# Altium project [G04]_QuadCharger18650.PrjPcb
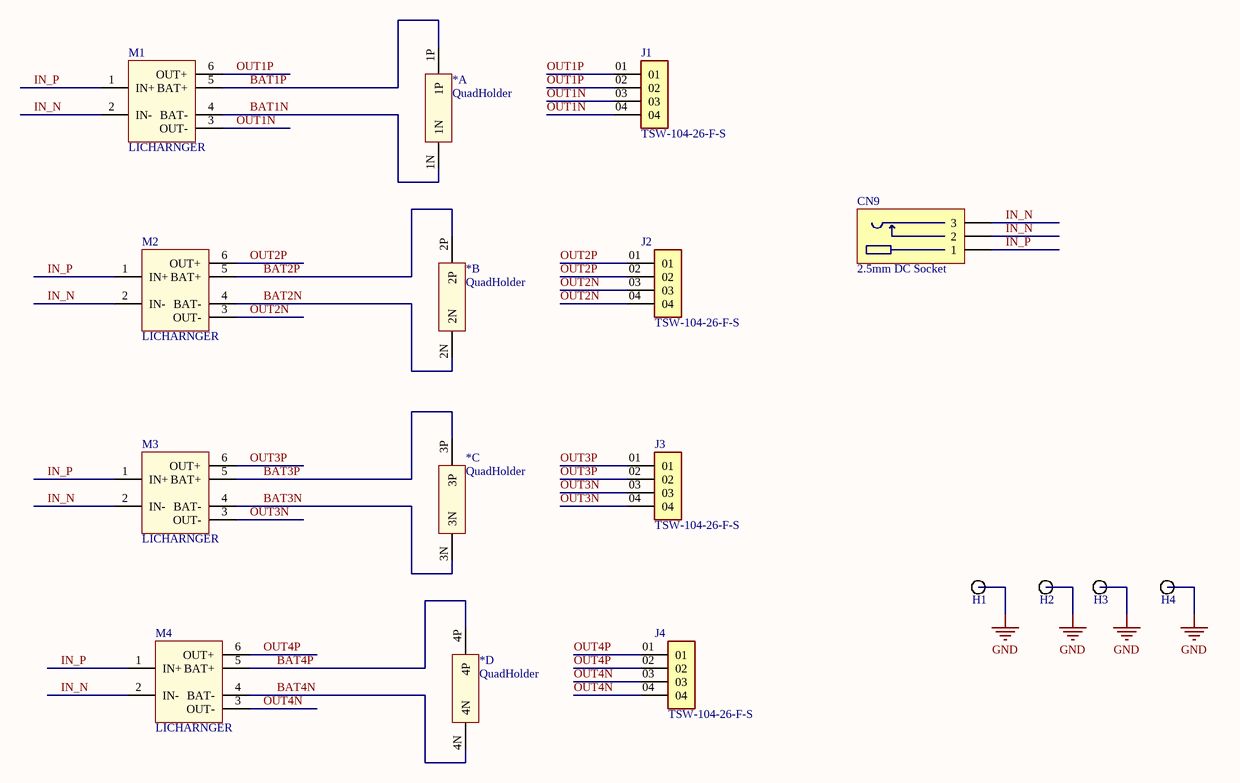
[diagram p0: QuadCharger18650.SchDoc]
1 sheet, 17 parts. Net scope: global (net labels, ports and power ports of the same name join across sheets).

## Sheet QuadCharger18650.SchDoc
size A4

### Parts
(Parts that share a designator on the sheet are numbered #1, #2 ... from top to bottom, then left to right.)
*#1  QuadHolder  [PCBComponent_1]  (part A of 4)
*#2  QuadHolder  [PCBComponent_1]  (part B of 4)
*#3  QuadHolder  [PCBComponent_1]  (part C of 4)
*#4  QuadHolder  [PCBComponent_1]  (part D of 4)
CN9  2.5mm DC Socket  [MJ-180PH]
H1  3.0MM HOLE+PAD  [HOLE-3.0MM+PAD]  (value not drawn)
H2  3.0MM HOLE+PAD  [HOLE-3.0MM+PAD]  (value not drawn)
H3  3.0MM HOLE+PAD  [HOLE-3.0MM+PAD]  (value not drawn)
H4  3.0MM HOLE+PAD  [HOLE-3.0MM+PAD]  (value not drawn)
J1  TSW-104-26-F-S  [SAMTEC_TSW-104-26-F-S]
J2  TSW-104-26-F-S  [SAMTEC_TSW-104-26-F-S]
J3  TSW-104-26-F-S  [SAMTEC_TSW-104-26-F-S]
J4  TSW-104-26-F-S  [SAMTEC_TSW-104-26-F-S]
M1  LICHARNGER  [LITHUMCHARGER]
M2  LICHARNGER  [LITHUMCHARGER]
M3  LICHARNGER  [LITHUMCHARGER]
M4  LICHARNGER  [LITHUMCHARGER]

### Nets
GND: H1.1 H2.1 H3.1 H4.1
BAT1N: *#1.1N M1.4(BAT-)
BAT1P: *#1.1P M1.5(BAT+)
BAT2N: *#2.2N M2.4(BAT-)
BAT2P: *#2.2P M2.5(BAT+)
BAT3N: *#3.3N M3.4(BAT-)
BAT3P: *#3.3P M3.5(BAT+)
BAT4N: *#4.4N M4.4(BAT-)
BAT4P: *#4.4P M4.5(BAT+)
IN_N: CN9.2 CN9.3 M1.2(IN-) M2.2(IN-) M3.2(IN-) M4.2(IN-)
IN_P: CN9.1 M1.1(IN+) M2.1(IN+) M3.1(IN+) M4.1(IN+)
OUT1N: J1.03 J1.04 M1.3(OUT-)
OUT1P: J1.01 J1.02 M1.6(OUT+)
OUT2N: J2.03 J2.04 M2.3(OUT-)
OUT2P: J2.01 J2.02 M2.6(OUT+)
OUT3N: J3.03 J3.04 M3.3(OUT-)
OUT3P: J3.01 J3.02 M3.6(OUT+)
OUT4N: J4.03 J4.04 M4.3(OUT-)
OUT4P: J4.01 J4.02 M4.6(OUT+)

### Library data of the parts
CN9 = 2.5mm DC Socket: power entry socket; UA P/N: 112-0004; Value: 2.5mm DC Socket; Type: SPC21365 5A 16V
M1-M4 = LICHARNGER: CHARNGER TL74
H1-H4 = 3.0MM HOLE+PAD: Value: 3.0MM HOLE+PAD
J1-J4 = TSW-104-26-F-S: Package: None; Price: None; Value: *; MP: TSW-104-26-F-S; Availability: Unavailable